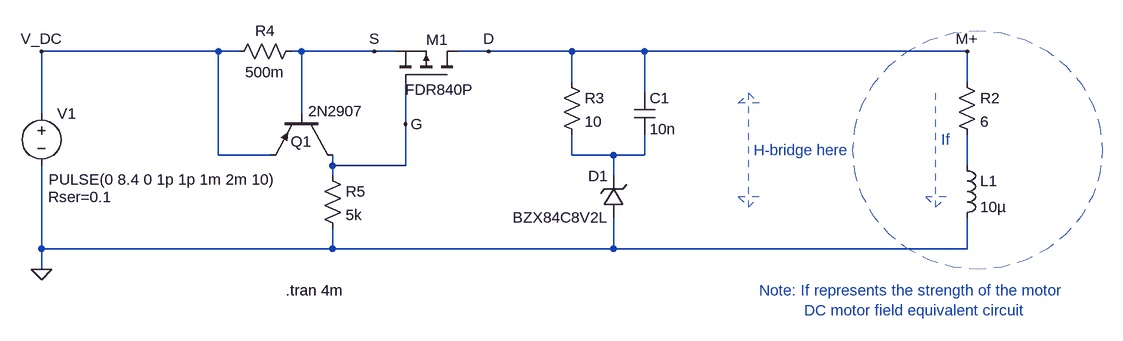
[diagram p0: schematic MotorCurrentLimit.asc]
MotorCurrentLimit.asc, the LTspice schematic file:
Version 4
SHEET 1 1932 680
WIRE 336 32 64 32
WIRE 368 32 336 32
WIRE 464 32 448 32
WIRE 576 32 464 32
WIRE 608 32 576 32
WIRE 752 32 704 32
WIRE 880 32 752 32
WIRE 992 32 880 32
WIRE 1488 32 992 32
WIRE 880 80 880 32
WIRE 1488 80 1488 32
WIRE 992 96 992 32
WIRE 64 128 64 32
WIRE 464 128 464 32
WIRE 624 144 624 80
WIRE 336 192 336 32
WIRE 416 192 336 192
WIRE 880 192 880 160
WIRE 944 192 880 192
WIRE 992 192 992 160
WIRE 992 192 944 192
WIRE 512 208 512 192
WIRE 624 208 624 144
WIRE 624 208 512 208
WIRE 1488 208 1488 160
WIRE 512 224 512 208
WIRE 944 224 944 192
WIRE 64 336 64 208
WIRE 512 336 512 304
WIRE 512 336 64 336
WIRE 944 336 944 288
WIRE 944 336 512 336
WIRE 1488 336 1488 288
WIRE 1488 336 944 336
WIRE 64 368 64 336
FLAG 64 368 0
FLAG 1488 32 M+
FLAG 624 144 G
FLAG 576 32 S
FLAG 752 32 D
FLAG 64 32 V_DC
SYMBOL voltage 64 112 R0
WINDOW 3 11 117 Left 2
WINDOW 123 0 0 Left 0
WINDOW 39 10 144 Left 2
SYMATTR Value PULSE(0 8.4 0 1p 1p 1m 2m 10)
SYMATTR SpiceLine Rser=0.1
SYMATTR InstName V1
SYMBOL res 1472 64 R0
SYMATTR InstName R2
SYMATTR Value 6
SYMBOL ind 1472 192 R0
SYMATTR InstName L1
SYMATTR Value 10µ
SYMBOL pmos 704 80 M270
WINDOW 0 66 48 VLeft 2
WINDOW 3 -11 -25 VRight 2
SYMATTR InstName M1
SYMATTR Value FDR840P
SYMBOL pnp 512 128 R90
WINDOW 0 43 32 VRight 2
WINDOW 3 -4 -47 VRight 2
SYMATTR InstName Q1
SYMATTR Value 2N2907
SYMBOL res 464 16 R90
WINDOW 0 0 56 VBottom 2
WINDOW 3 32 56 VTop 2
SYMATTR InstName R4
SYMATTR Value 500m
SYMBOL res 496 208 R0
SYMATTR InstName R5
SYMATTR Value 5k
SYMBOL res 864 64 R0
SYMATTR InstName R3
SYMATTR Value 10
SYMBOL cap 976 96 R0
SYMATTR InstName C1
SYMATTR Value 10n
SYMBOL zener 960 288 R180
WINDOW 0 24 64 Left 2
WINDOW 3 24 0 Left 2
SYMATTR InstName D1
SYMATTR Value BZX84C8V2L
SYMATTR Description Diode
SYMATTR Type diode
TEXT 440 400 Left 2 !.tran 4m
TEXT 1448 168 Left 2 ;If
TEXT 1168 400 Left 2 ;Note: If represents the strength of the motor\n          DC motor field equivalent circuit
TEXT 1160 184 Left 2 ;H-bridge here
LINE Normal 1440 272 1440 96 2
LINE Normal 1424 256 1440 272 2
LINE Normal 1456 256 1424 256 2
LINE Normal 1440 272 1456 256 2
LINE Normal 1152 272 1152 96 2
LINE Normal 1136 256 1152 272 2
LINE Normal 1168 256 1136 256 2
LINE Normal 1152 272 1168 256 2
LINE Normal 1136 112 1152 96 2
LINE Normal 1168 112 1136 112 2
LINE Normal 1152 96 1168 112 2
CIRCLE Normal 1696 368 1312 0 2

The netlist it stands for:
* MotorCurrentLimit.asc
V1 V_DC 0 PULSE(0 8.4 0 1p 1p 1m 2m 10) Rser=0.1
R2 D N002 6
L1 N002 0 10µ
M1 D G S S FDR840P
Q1 G S V_DC 0 2N2907
R4 S V_DC 500m
R5 G 0 5k
R3 D N001 10
C1 D N001 10n
D1 0 N001 BZX84C8V2L
.model D D
.lib standard.dio
.model NPN NPN
.model PNP PNP
.lib standard.bjt
.model NMOS NMOS
.model PMOS PMOS
.lib standard.mos
.tran 4m
* If
* Note: If represents the strength of the motor
*           DC motor field equivalent circuit
* H-bridge here
.backanno
.end